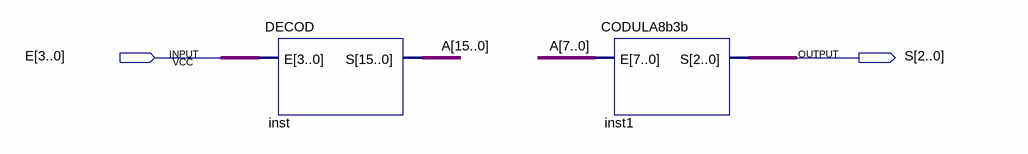
[diagram p0: schematic sheet]
// Quartus schematic teste_dec_cod.bdf as structural Verilog: 2 symbols, 2 pins
module teste_dec_cod (
  input  [3:0] E,
  output [2:0] S
);

  wire [15:0] A;

  DECOD inst (.E(E), .S(A));
  CODULA8b3b inst1 (.E(A[7:0]), .S(S));
endmodule
